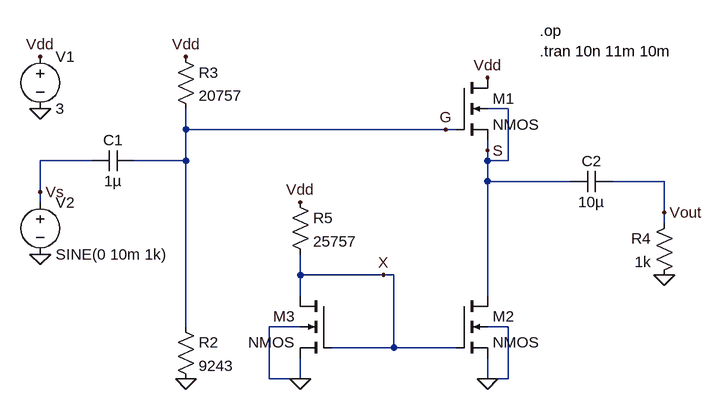
[diagram p0: schematic current-source.asc]
current-source.asc, the LTspice schematic file:
Version 4
SHEET 1 1228 680
WIRE 240 208 208 208
WIRE -256 240 -256 208
WIRE 144 240 -256 240
WIRE 160 240 144 240
WIRE 208 272 208 256
WIRE -400 288 -480 288
WIRE -256 288 -256 240
WIRE -256 288 -336 288
WIRE 208 288 208 272
WIRE 240 288 240 208
WIRE 240 288 208 288
WIRE 208 320 208 288
WIRE 336 320 208 320
WIRE 480 320 400 320
WIRE -480 336 -480 288
WIRE -480 352 -480 336
WIRE 480 368 480 320
WIRE 480 384 480 368
WIRE -80 464 -80 432
WIRE 48 464 -80 464
WIRE 64 464 48 464
WIRE -80 496 -80 464
WIRE 208 496 208 320
WIRE -256 544 -256 288
WIRE -80 544 -128 544
WIRE 240 544 208 544
WIRE 64 576 64 464
WIRE 64 576 -32 576
WIRE 160 576 64 576
WIRE -128 624 -128 544
WIRE -80 624 -80 592
WIRE -80 624 -128 624
WIRE 208 624 208 592
WIRE 240 624 240 544
WIRE 240 624 208 624
FLAG -480 128 Vdd
FLAG -256 128 Vdd
FLAG 208 160 Vdd
FLAG -480 208 0
FLAG -256 624 0
FLAG 144 240 G
FLAG 208 272 S
FLAG -480 432 0
FLAG 480 464 0
FLAG -80 352 Vdd
FLAG -80 624 0
FLAG 208 624 0
FLAG -480 336 Vs
FLAG 480 368 Vout
FLAG 48 464 X
DATAFLAG -160 240 "$"
DATAFLAG 208 400 "$"
DATAFLAG 64 576 "$"
SYMBOL Res -272 528 R0
SYMATTR InstName R2
SYMATTR Value 9243
SYMBOL Res -272 112 R0
SYMATTR InstName R3
SYMATTR Value 20757
SYMBOL voltage -480 112 R0
SYMATTR InstName V1
SYMATTR Value 3
SYMBOL nmos4 160 160 R0
SYMATTR InstName M1
SYMATTR Value2 l=0.18 w=10
SYMBOL voltage -480 336 R0
SYMATTR InstName V2
SYMATTR Value SINE(0 10m 1k)
SYMBOL Cap -400 272 M90
WINDOW 0 0 32 VBottom 2
WINDOW 3 32 32 VTop 2
SYMATTR InstName C1
SYMATTR Value 1µ
SYMBOL Cap 336 304 M90
WINDOW 0 0 32 VBottom 2
WINDOW 3 32 32 VTop 2
SYMATTR InstName C2
SYMATTR Value 10µ
SYMBOL Res 496 368 M0
SYMATTR InstName R4
SYMATTR Value 1k
SYMBOL nmos4 160 496 R0
SYMATTR InstName M2
SYMATTR Value2 l=0.18 w=10
SYMBOL nmos4 -32 496 M0
SYMATTR InstName M3
SYMATTR Value2 l=0.18 w=10
SYMBOL Res -96 336 R0
SYMATTR InstName R5
SYMATTR Value 25757
TEXT 288 88 Left 2 !.op\n.tran 10n 11m 10m

The netlist it stands for:
* current-source.asc
R2 G 0 9243
R3 Vdd G 20757
V1 Vdd 0 3
M1 Vdd G S S NMOS l=0.18 w=10
V2 Vs 0 SINE(0 10m 1k)
C1 Vs G 1µ
C2 S Vout 10µ
R4 Vout 0 1k
M2 S X 0 0 NMOS l=0.18 w=10
M3 X X 0 0 NMOS l=0.18 w=10
R5 Vdd X 25757
.model NMOS NMOS
.model PMOS PMOS
.lib standard.mos
.op
.tran 10n 11m 10m
.backanno
.end